# Altium schematic sheet Esquematico_Bloques.SchDoc
size A4
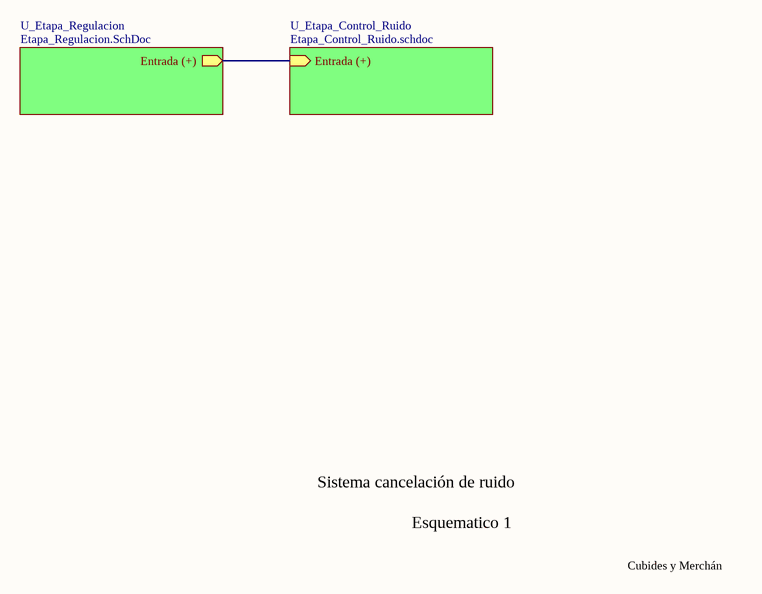
[diagram p0: Esquematico_Bloques.SchDoc]

## Sub-sheets
U_Etapa_Control_Ruido = Etapa_Control_Ruido.schdoc: Entrada (+) (in)
U_Etapa_Regulacion = Etapa_Regulacion.SchDoc: Entrada (+) (out)

## Nets
(unnamed): sheet U_Etapa_Control_Ruido/Entrada (+), sheet U_Etapa_Regulacion/Entrada (+)

## Notes on the sheet
- Sistema cancelación de ruido
- Esquematico 1
- Cubides y Merchán